# EAGLE design relay_shield3b (EAGLE 7.7.0)
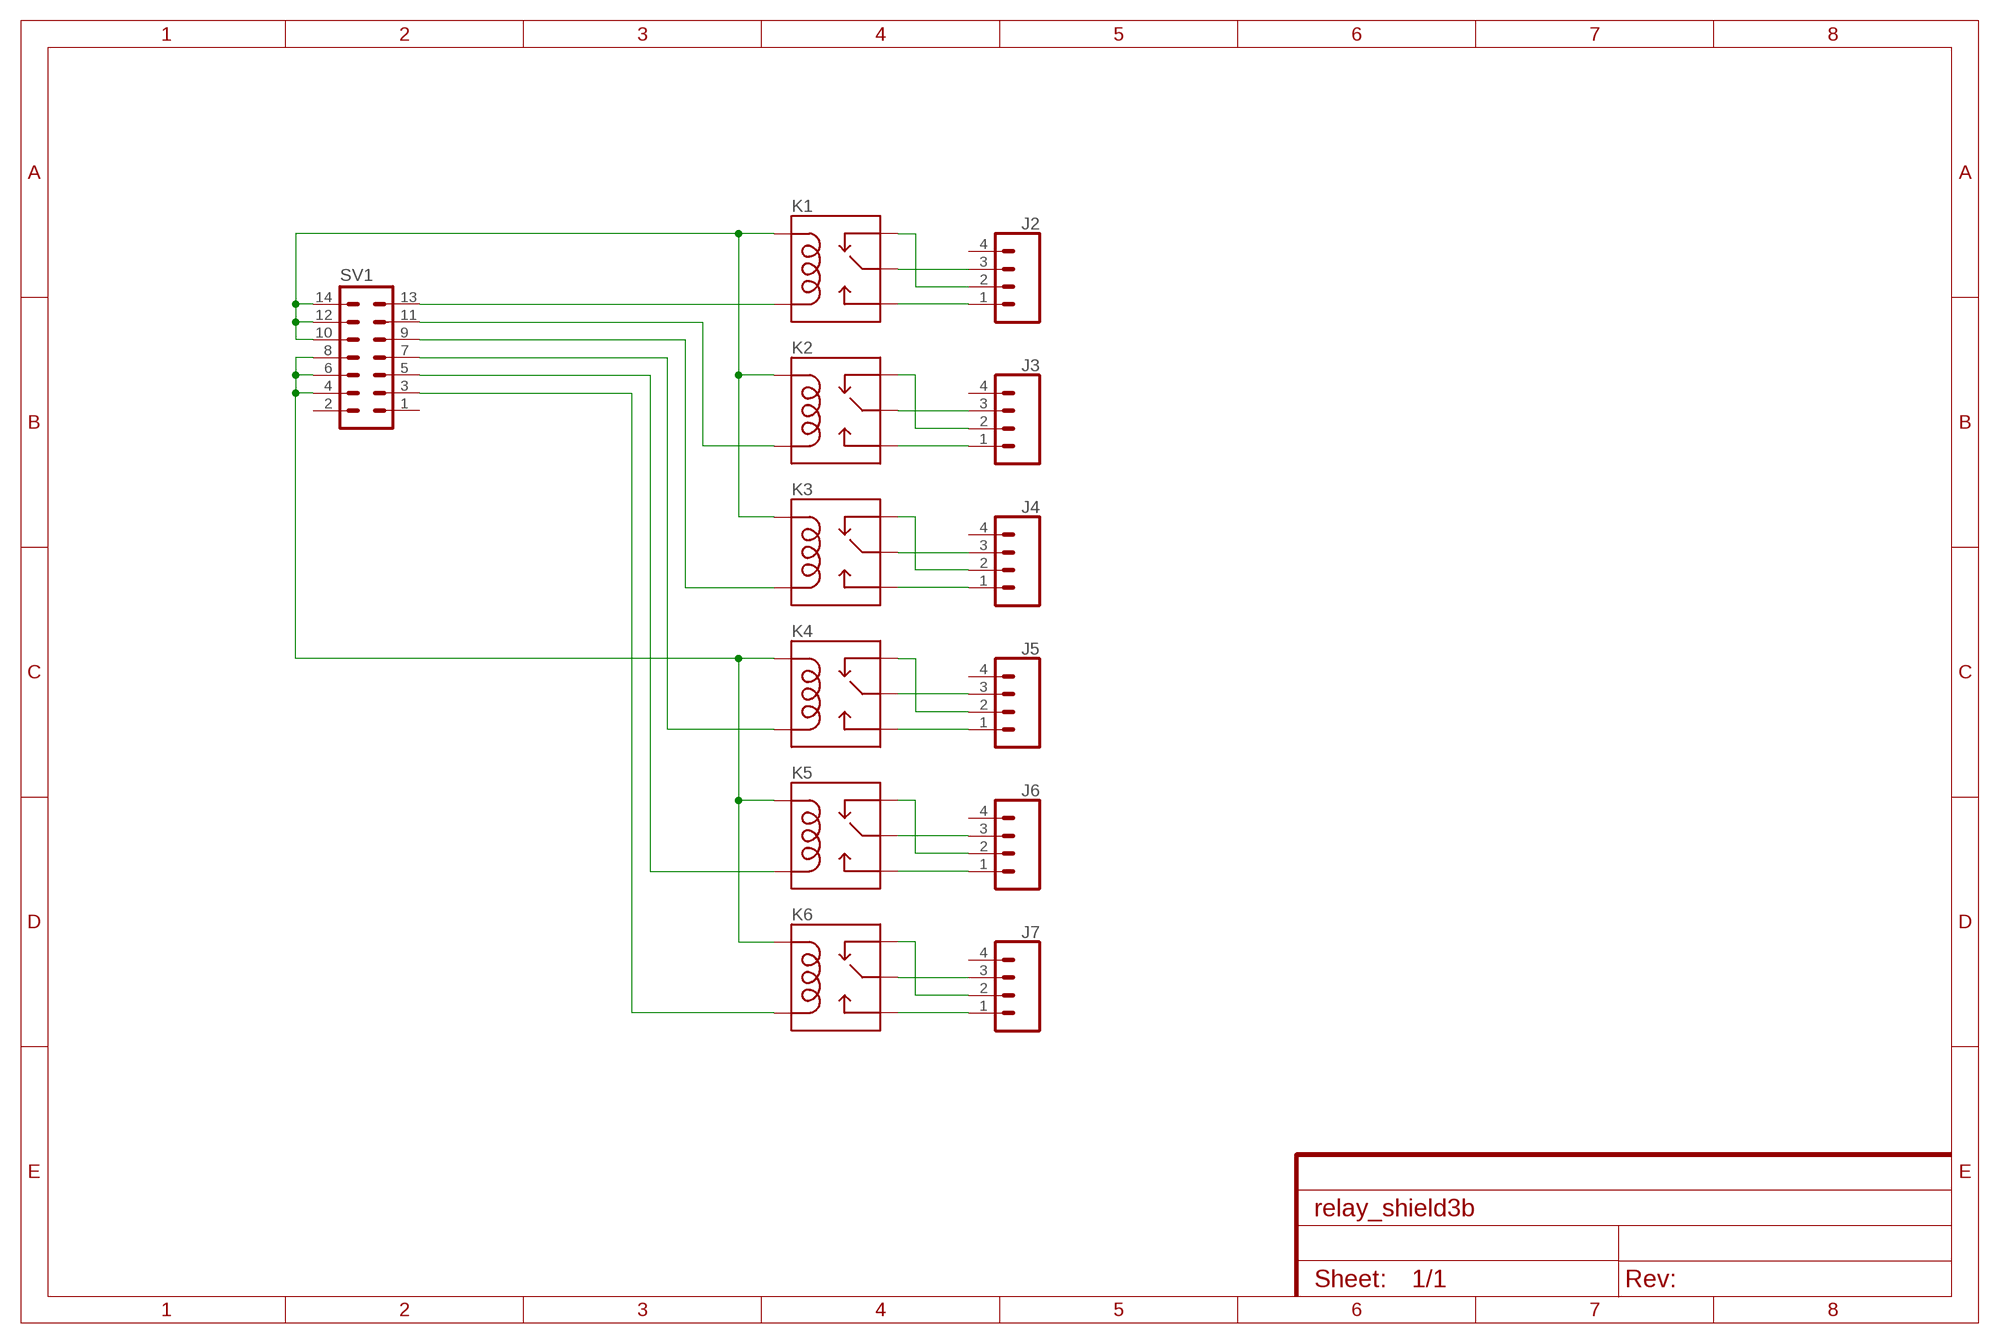
[diagram p0: schematic, sheet 1]

## Parts
J2  CONN_04SCREW  [SCREWTERMINAL-3.5MM-4]
J3  CONN_04SCREW  [SCREWTERMINAL-3.5MM-4]
J4  CONN_04SCREW  [SCREWTERMINAL-3.5MM-4]
J5  CONN_04SCREW  [SCREWTERMINAL-3.5MM-4]
J6  CONN_04SCREW  [SCREWTERMINAL-3.5MM-4]
J7  CONN_04SCREW  [SCREWTERMINAL-3.5MM-4]
K1  RELAY-SPDTPTH6  [RELAY-SCHRACK-RY211]
K2  RELAY-SPDTPTH6  [RELAY-SCHRACK-RY211]
K3  RELAY-SPDTPTH6  [RELAY-SCHRACK-RY211]
K4  RELAY-SPDTPTH6  [RELAY-SCHRACK-RY211]
K5  RELAY-SPDTPTH6  [RELAY-SCHRACK-RY211]
K6  RELAY-SPDTPTH6  [RELAY-SCHRACK-RY211]
SV1  ML14L  [ML14L]

## Nets
N$1: K1.A2(COIL2) SV1.13
N$2: J2.3 K1.11(MAIN)
N$3: J3.3 K2.11(MAIN)
N$6: K4.A1(COIL1) K5.A1(COIL1) K6.A1(COIL1) SV1.4 SV1.6 SV1.8
N$7: J3.2 K2.12(NC)
N$8: J4.3 K3.11(MAIN)
N$9: J5.2 K4.12(NC)
N$10: J7.3 K6.11(MAIN)
N$11: J7.2 K6.12(NC)
N$12: J4.2 K3.12(NC)
N$13: K2.A2(COIL2) SV1.11
N$14: K3.A2(COIL2) SV1.9
N$15: K4.A2(COIL2) SV1.7
N$16: K5.A2(COIL2) SV1.5
N$17: K6.A2(COIL2) SV1.3
N$18: J5.3 K4.11(MAIN)
N$19: J6.2 K5.12(NC)
N$20: J6.3 K5.11(MAIN)
N$22: K1.A1(COIL1) K2.A1(COIL1) K3.A1(COIL1) SV1.10 SV1.12 SV1.14
N$32: J2.2 K1.12(NC)
N$33: J2.1 K1.14(NO)
N$35: J3.1 K2.14(NO)
N$37: J4.1 K3.14(NO)
N$39: J5.1 K4.14(NO)
N$41: J6.1 K5.14(NO)
N$43: J7.1 K6.14(NO)
Unconnected: J2.4 J3.4 J4.4 J5.4 J6.4 J7.4 SV1.1 SV1.2

## Library data of the parts
J2-J7 = SparkFun-Connectors:CONN_04: Multi connection point. Often used as Generic Header-pin footprint for 0.1 inch spaced/style header connections On any of the 0.1 inch spaced packages, you can populate with these: Break Away Headers - Straight <https://www.sparkfun.com/products/116> (PRT-00116) Break Away Male Headers - Right Angle <https://www.sparkfun.com/products/553> (PRT-00553) Female Headers <https://www.sparkfun.com/products/115> (PRT-00115) Break Away Headers - Machine Pin <https://www.sparkfun.com/products/117> (PRT-00117) Break Away Female Headers - Swiss Machine Pin <https://www.sparkfun.com/products/743> (PRT-00743) For SCREWTERMINALS and SPRING TERMINALS visit here: Screw Terimnals on SparkFun.com <https://www.sparkfun.com/search/results?term=Screw+Terminals> (5mm/3.5mm/2.54mm spacing) This device is also useful as a general connection point to wire up your design to another part of your project. Our various solder wires solder well into these plated through hole pads. Hook-Up Wire - Assortment (Stranded, 22 AWG) <https://www.sparkfun.com/products/11375> (PRT-11375) Hook-Up Wire - Assortment (Solid Core, 22 AWG) <https://www.sparkfun.com/products/11367> (PRT-11367) View the entire wire category on our website here <https://www.sparkfun.com/categories/141> Special notes: Molex polarized connector foot print use with SKU : PRT-08231 with associated crimp pins and housings. 1MM SMD Version SKU: PRT-10208; PROD_ID: 2xCONN-08399; SF_ID: 2xPRT-08084
K1-K6 = kg-relays:RELAY-SPDT: SPDT relay (COM-00101)
SV1 = con-ml:ML14L: HARTING; OC_FARNELL: unknown; OC_NEWARK: unknown

## Board
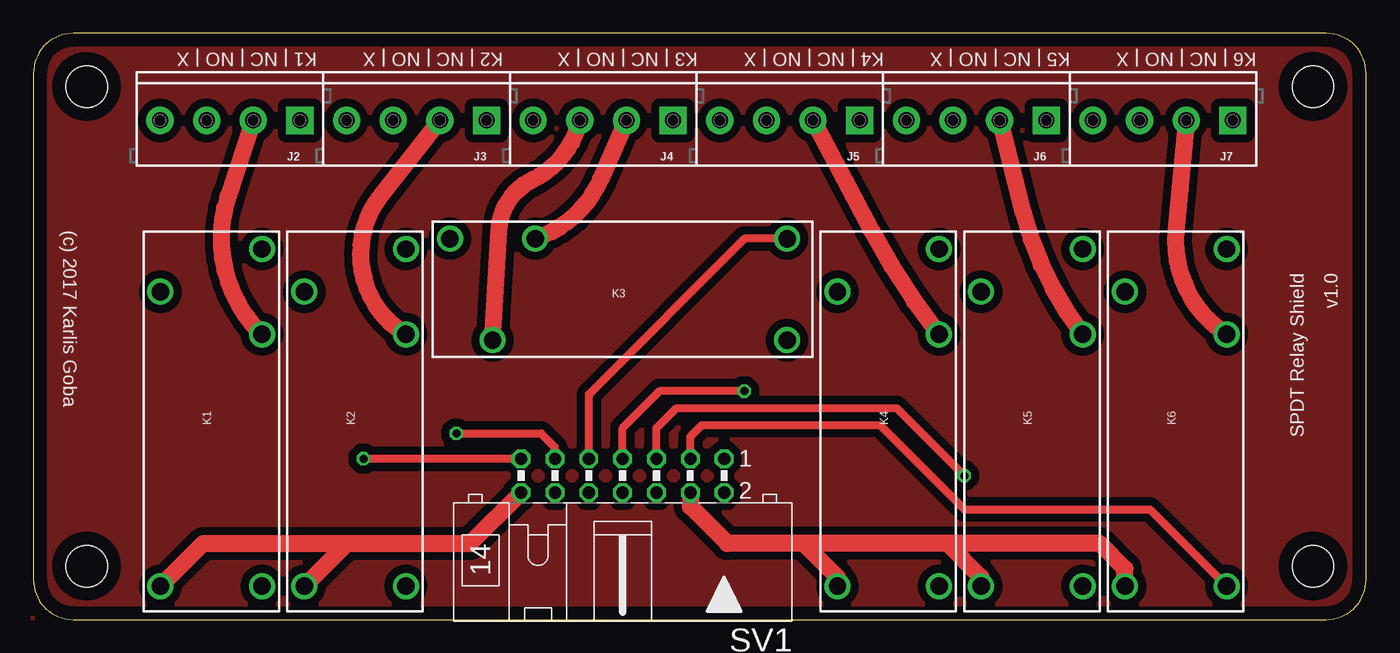
[diagram p1: board, top side]
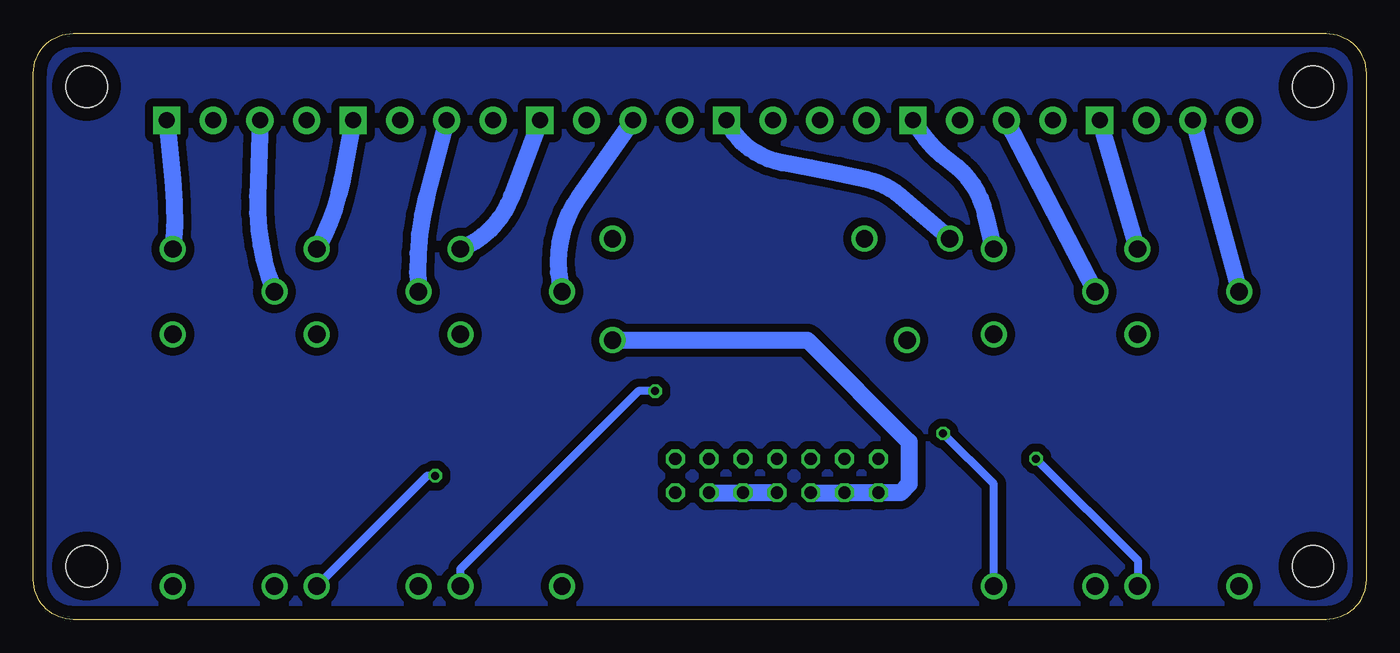
[diagram p2: board, bottom side, seen from below]

Size 100 x 44 mm. Coordinates in mm from the lower left corner, seen from the top.
Outline: 0,41 0,3 arc90 3,0 97,0 arc90 100,3 100,41 arc90 97,44 3,44 arc90 0,41
Copper layers (1*16): Top 0.035mm / dielectric 1.5mm / Bottom 0.035mm
Design rules "default": minimum track width 10mil, minimum drill 24mil, track to track 8mil, track to pad 8mil, pad to pad 8mil, via to via 8mil, smd to smd 8mil, copper to edge 40mil, drill to drill 8mil, minimum pad ring 10mil, minimum via ring 8mil, stop-mask expansion 4mil, vias tented up to drill 0mil, thermal gap 10mil
Holes 3.1 mm at 4,40 96,40 4,4 96,4

### Footprints (pad centres in the part's own frame; a part is rotated, then mirrored left to right if it is on the bottom)
SCREWTERMINAL-3.5MM-4 = drill 1.2 pad 2.032 square: 1 0,0 | drill 1.2 pad 2.032: 2 3.5,0; 3 7,0; 4 10.5,0
RELAY-SCHRACK-RY211 = drill 1.3: 11 10,3.81; 12 6.8,-3.81; 14 13.2,-3.81; A1 -12.1,3.81; A2 -12.1,-3.81
ML14L = drill 0.914 octagon: 1 -7.62,-1.27; 2 -7.62,1.27; 3 -5.08,-1.27; 4 -5.08,1.27; 5 -2.54,-1.27; 6 -2.54,1.27; 7 0,-1.27; 8 0,1.27; 9 2.54,-1.27; 10 2.54,1.27; 11 5.08,-1.27; 12 5.08,1.27; 13 7.62,-1.27; 14 7.62,1.27

### Placement (x,y rotation side)
J2  20,37.47 180 top
J3  34,37.47 180 top
J4  48,37.47 180 top
J5  62,37.47 180 top
J6  76,37.47 180 top
J7  90,37.47 180 top
K1  13.35,14.61 90 top
K2  24.14,14.61 90 top
K3  44.45,24.77 180 top
K4  64.14,14.61 90 top
K5  74.92,14.61 90 top
K6  85.72,14.61 90 top
SV1  44.22,10.79 180 top

### Tracks (layer width: path | path; a pad name or v marks a point on that pad's centre or on a via)
GND
  pour Bottom (isolate 0.61): 99.69,43.88 99.69,0.01 0,0.01 0,43.88
  pour Top (isolate 0.61): 99.69,43.88 99.69,0.01 0,0.01 0,43.88
N$1  (via drill 0.6)
  Top 0.61: SV1.13 v24.77,12.06
  Bottom 0.61: v24.77,12.06 17.14,4.45 17.14,2.52 K1.A2
N$2
  Bottom 1.27: J2.3 K1.11
N$3
  Bottom 1.27: K2.11 J3.3
N$6
  Top 1.27: 68.58,5.71 80.01,5.71 81.91,3.82 K6.A1 | K5.A1 71.11,3.19 68.58,5.71 | 68.58,5.71 57.78,5.71 | 57.78,5.71 52.07,5.71 49.3,8.49 SV1.4 | K4.A1 60.34,3.17 57.78,5.71
  Bottom 1.27: SV1.8 SV1.6 SV1.4
N$7
  Top 1.27: J3.2 26.04,31.75 arc97 K2.12
N$8
  Top 1.27: K3.11 34.92,29.21 arc-61 37.47,33.02 arc51 J4.3
N$9
  Top 1.27: J5.2 62.87,29.21 arc10 K4.12
N$10
  Bottom 1.27: J7.3 83.19,31.75 arc-24 K6.11
N$11
  Top 1.27: J7.2 85.72,29.21 arc63 K6.12
N$12
  Top 1.27: J4.2 42.55,33.02 arc-48 K3.12
N$13  (via drill 0.6)
  Top 0.61: v31.75,13.97 38.1,13.97 39.13,12.94 SV1.11
  Bottom 0.61: v31.75,13.97 27.95,10.17 K2.A2
N$14
  Top 0.61: SV1.9 41.67,16.91 53.35,28.59 K3.A2
N$15  (via drill 0.6)
  Top 0.61: v53.34,17.14 46.99,17.14 44.22,14.37 SV1.7
  Bottom 0.61: K4.A2 67.95,3.8 54.61,17.14 v53.34,17.14
N$16  (via drill 0.6)
  Top 0.61: v69.85,10.79 64.77,15.88 48.26,15.88 46.76,14.37 SV1.5
  Bottom 0.61: v69.85,10.79 70.44,10.79 K5.A2
N$17
  Top 0.61: K6.A2 83.78,8.26 69.85,8.26 63.5,14.61 50.16,14.61 49.3,13.73 SV1.3
N$18
  Bottom 1.27: J5.3 59.05,31.75 arc-50 K4.11
N$19
  Top 1.27: J6.2 74.3,30.48 arc23 K5.12
N$20
  Bottom 1.27: J6.3 70.48,31.75 arc-19 K5.11
N$22
  Top 1.27: K1.A1 12.74,5.71 23.54,5.71 | K2.A1 23.54,5.71 | 23.54,5.71 32.78,5.71 SV1.14
  Bottom 1.27: SV1.10 SV1.12 SV1.14 34.92,9.53 34.29,10.16 34.29,13.34 41.92,20.96 K3.A1
N$32
  Top 1.27: J2.2 14.61,31.75 arc64 K1.12
N$33
  Bottom 1.27: K1.14 J2.1
N$35
  Bottom 1.27: K2.14 28.57,30.48 arc-41 31.11,34.29 arc24 J3.1
N$37
  Bottom 1.27: K3.14 34.92,31.75 arc-28 37.47,33.02 arc-2 43.81,34.29 arc54 J4.1
N$39
  Bottom 1.27: J5.1 64.14,31.75 arc47 K4.14
N$41
  Bottom 1.27: J6.1 76.83,33.02 arc19 K5.14
N$43
  Bottom 1.27: J7.1 89.53,33.02 arc12 K6.14

### Text on the board
tPlace: K1 | NC | NO | X | K2 | NC | NO | X | K3 | NC | NO | X | K4 | NC | NO | X | K5 | NC | NO | X | K6 | NC | NO | X | (c) 2017 Karlis Goba | SPDT Relay Shield | v1.0